# EAGLE design transformerboard (EAGLE 7.5.0)
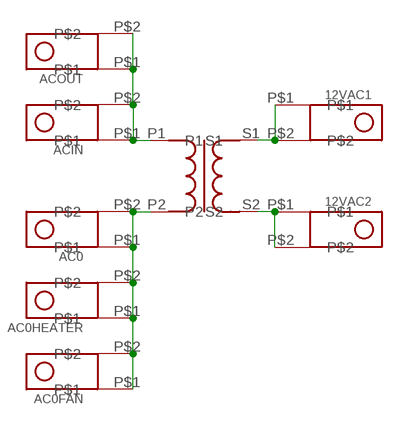
[diagram p0: schematic, sheet 1]

## Parts
12VAC1  QUICKCONNECT-TAB  [QUICKCONNECT-TAB-6.35X0.81]
12VAC2  QUICKCONNECT-TAB  [QUICKCONNECT-TAB-6.35X0.81]
AC0  QUICKCONNECT-TAB  [QUICKCONNECT-TAB-6.35X0.81]
AC0FAN  QUICKCONNECT-TAB  [QUICKCONNECT-TAB-6.35X0.81]
AC0HEATER  QUICKCONNECT-TAB  [QUICKCONNECT-TAB-6.35X0.81]
ACIN  QUICKCONNECT-TAB  [QUICKCONNECT-TAB-6.35X0.81]
ACOUT  QUICKCONNECT-TAB  [QUICKCONNECT-TAB-6.35X0.81]
T1  TRANSFORMER  [1.6X1.4.X1.3]

## Nets
N$1: ACIN.P$1 ACIN.P$2 ACOUT.P$1 ACOUT.P$2 T1.P1
N$2: AC0.P$1 AC0.P$2 AC0FAN.P$1 AC0FAN.P$2 AC0HEATER.P$1 AC0HEATER.P$2 T1.P2
N$3: 12VAC1.P$1 12VAC1.P$2 T1.S1
N$4: 12VAC2.P$1 12VAC2.P$2 T1.S2

## Library data of the parts
12VAC1 12VAC2 AC0 AC0FAN AC0HEATER ACIN ACOUT = Wafer-Connectors:QUICKCONNECT-TAB
T1 = transformers:TRANSFORMER

## Board
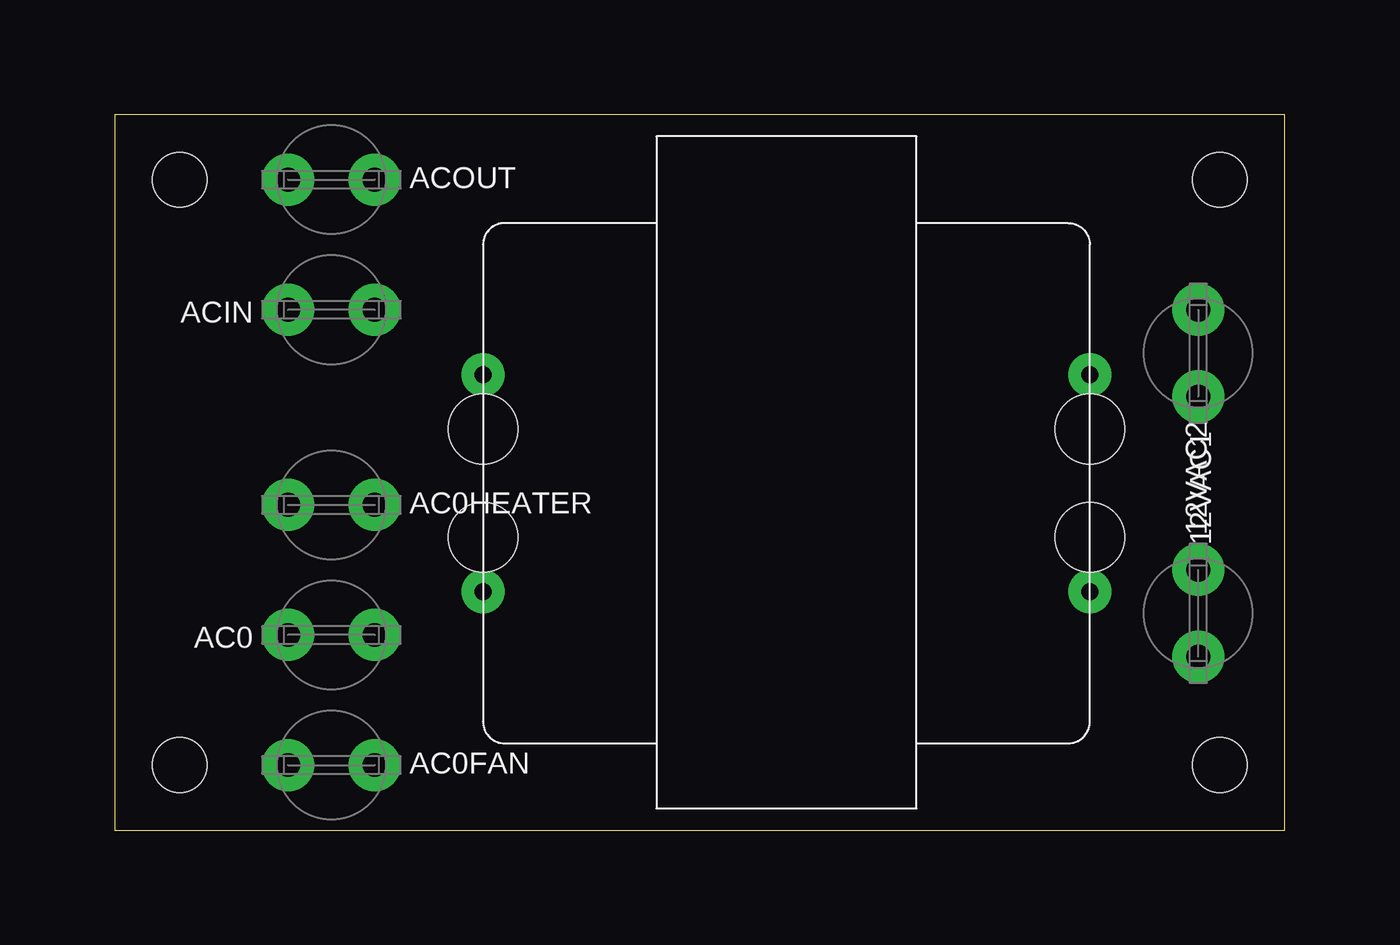
[diagram p1: board, top side]
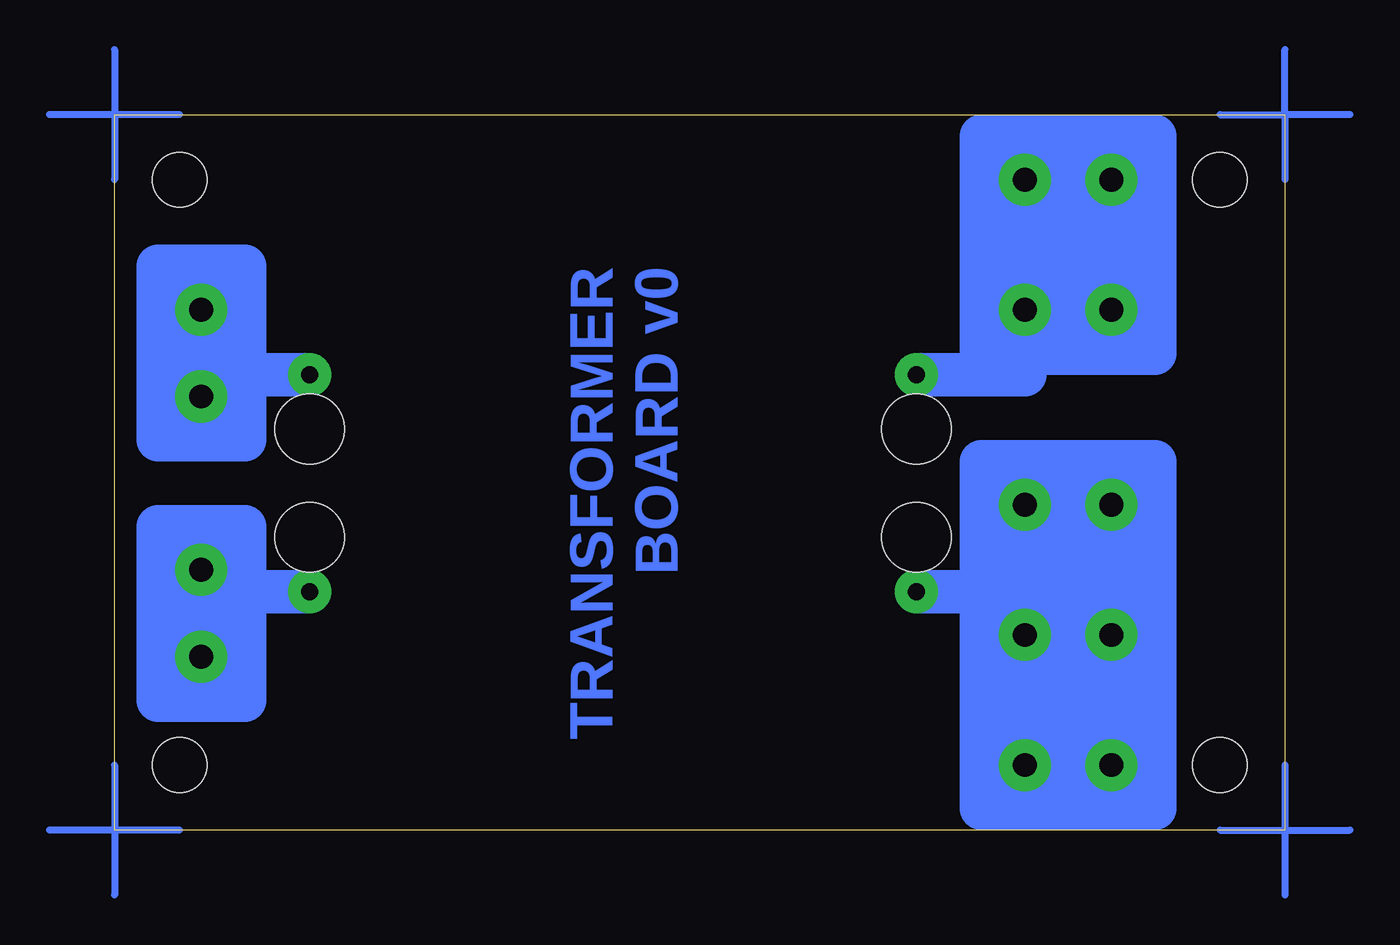
[diagram p2: board, bottom side, seen from below]

Size 68.58 x 41.91 mm. Coordinates in mm from the lower left corner, seen from the top.
Outline: 0,0 68.58,0 68.58,41.91 0,41.91 0,0
Copper layers (1*16): Top 0.035mm / dielectric 1.5mm / Bottom 0.035mm
Design rules "default": minimum track width 10mil, minimum drill 24mil, track to track 8mil, track to pad 8mil, pad to pad 8mil, via to via 8mil, smd to smd 8mil, copper to edge 40mil, drill to drill 8mil, minimum pad ring 10mil, minimum via ring 8mil, stop-mask expansion 4mil, vias tented up to drill 0mil, thermal gap 10mil
Holes 3.2 mm at 3.81,3.81 3.81,38.1 64.77,3.81 64.77,38.1
Holes 4.06 mm at 21.59,23.5 21.59,17.14 57.15,23.5 57.15,17.14

### Footprints (pad centres in the part's own frame; a part is rotated, then mirrored left to right if it is on the bottom)
QUICKCONNECT-TAB-6.35X0.81 = drill 1.4 pad 3.048: P$1 2.54,0; P$2 -2.54,0
1.6X1.4.X1.3 = drill 1 pad 2.54: P1 -17.78,6.35; P2 -17.78,-6.35; S1 17.78,6.35; S2 17.78,-6.35

### Placement (x,y rotation side)
12VAC1  63.5,27.94 270 top
12VAC2  63.5,12.7 90 top
AC0  12.7,11.43 180 top
AC0FAN  12.7,3.81 0 top
AC0HEATER  12.7,19.05 0 top
ACIN  12.7,30.48 180 top
ACOUT  12.7,38.1 0 top
T1  39.37,20.32 0 top

### Tracks (layer width: path | path; a pad name or v marks a point on that pad's centre or on a via)
N$1
  Bottom 2.54: T1.P1 15.24,26.67 15.24,29.21 | 15.24,29.21 ACIN.P$2 | ACIN.P$2 ACIN.P$1 | ACOUT.P$2 ACOUT.P$1 | ACOUT.P$2 ACIN.P$1 | ACOUT.P$2 10.16,39.37 | 10.16,39.37 15.24,39.37 | 15.24,39.37 ACOUT.P$1 | ACOUT.P$1 ACIN.P$2 | 15.24,29.21 10.16,29.21 ACIN.P$1 | 10.16,39.37 7.62,39.37 | 7.62,39.37 7.62,29.21 | 7.62,29.21 17.78,29.21 | 17.78,29.21 17.78,36.83 17.78,39.37 | 17.78,39.37 15.24,39.37 | 7.62,29.21 7.62,27.94 17.78,27.94 17.78,29.21 | 7.62,39.37 7.62,40.64 17.78,40.64 17.78,39.37
N$2
  Bottom 2.54: T1.P2 15.24,13.97 AC0.P$2 | AC0.P$2 AC0FAN.P$1 | AC0FAN.P$1 AC0FAN.P$2 | AC0.P$2 AC0.P$1 | AC0.P$2 AC0HEATER.P$1 | AC0HEATER.P$1 AC0HEATER.P$2 | AC0HEATER.P$2 AC0FAN.P$2 | AC0HEATER.P$2 10.16,20.32 15.24,20.32 AC0HEATER.P$1 | AC0FAN.P$1 15.24,2.54 10.16,2.54 AC0FAN.P$2
N$3
  Bottom 2.54: T1.S1 63.5,26.67 12VAC1.P$1 12VAC1.P$2
N$4
  Bottom 2.54: T1.S2 63.5,13.97 12VAC2.P$1 12VAC2.P$2
N$5  (via drill 0.6)
  other vias: 3.81,3.81
N$6  (via drill 0.6)
  other vias: 64.77,3.81
N$7  (via drill 0.6)
  other vias: 64.77,38.1
N$8  (via drill 0.6)
  other vias: 3.81,38.1
N$9  (via drill 0.6)
  other vias: 21.59,23.5
N$10  (via drill 0.6)
  other vias: 21.59,17.14
N$11  (via drill 0.6)
  other vias: 57.15,17.14
N$12  (via drill 0.6)
  other vias: 57.15,23.5
N$13
  Bottom 2.54: 63.5,33.02 62.23,33.02 | 62.23,33.02 62.23,25.4 63.5,25.4 63.5,33.02 | 63.5,33.02 64.77,33.02 | 64.77,33.02 64.77,25.4 | 64.77,33.02 66.04,33.02 66.04,24.13 | 66.04,24.13 60.96,24.13 | 60.96,24.13 60.96,33.02 62.23,33.02 | 60.96,24.13 60.96,22.86 66.04,22.86 66.04,24.13
N$14
  Bottom 2.54: 62.23,16.51 64.77,16.51 64.77,7.62 62.23,7.62 62.23,16.51
N$15
  Bottom 2.54: 60.96,17.78 66.04,17.78 66.04,7.62 60.96,7.62 60.96,17.78
N$16
  Bottom 2.54: 17.78,2.54 17.78,21.59 7.62,21.59 7.62,2.54 | 17.78,2.54 7.62,2.54 | 7.62,2.54 7.62,1.27 17.78,1.27 17.78,2.54
N$34
  Bottom 0.406: -3.81,41.91 0,41.91 | 3.81,41.91 0,41.91 | 0,41.91 0,45.72 | 0,41.91 0,38.1
N$35
  Bottom 0.406: 0,3.81 0,-3.81
N$36
  Bottom 0.406: 3.81,0 -3.81,0
N$37
  Bottom 0.406: 64.77,0 72.39,0
N$38
  Bottom 0.406: 68.58,3.81 68.58,-3.81
N$39
  Bottom 0.406: 64.77,41.91 72.39,41.91
N$40
  Bottom 0.406: 68.58,45.72 68.58,38.1
(copper drawn outside any net)
  shapes: Bottom area x2

### Text on the board
Bottom: TRANSFORMER / BOARD v0